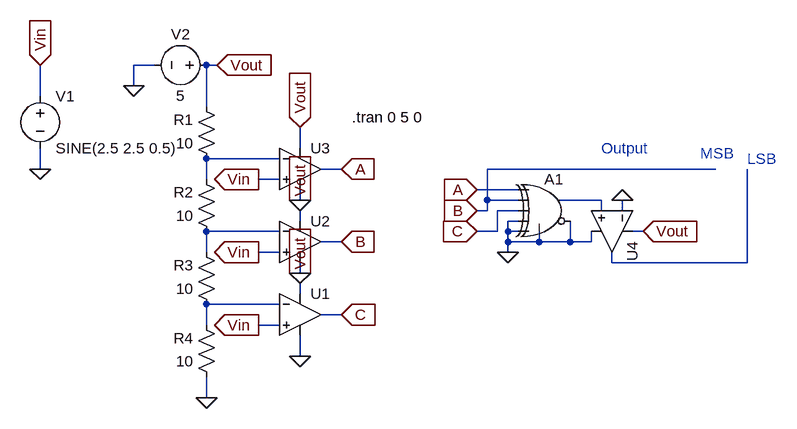
[diagram p0: schematic 2bitADC.asc]
2bitADC.asc, the LTspice schematic file:
Version 4.1
SHEET 1 1728 680
WIRE 288 64 256 64
WIRE 384 64 368 64
WIRE 256 96 256 64
WIRE 112 112 112 64
WIRE 368 128 368 64
WIRE 512 192 512 160
WIRE 480 208 368 208
WIRE 112 224 112 192
WIRE 576 224 544 224
WIRE 1152 224 800 224
WIRE 368 240 368 208
WIRE 480 240 448 240
WIRE 848 256 784 256
WIRE 512 272 512 256
WIRE 800 272 800 224
WIRE 848 272 800 272
WIRE 976 272 912 272
WIRE 800 288 800 272
WIRE 800 288 784 288
WIRE 848 288 816 288
WIRE 976 288 976 272
WIRE 1008 288 1008 272
WIRE 512 304 512 288
WIRE 848 304 832 304
WIRE 480 320 368 320
WIRE 816 320 816 288
WIRE 816 320 784 320
WIRE 832 320 832 304
WIRE 848 320 832 320
WIRE 1040 320 1024 320
WIRE 576 336 544 336
WIRE 832 336 832 320
WIRE 880 336 880 320
WIRE 880 336 832 336
WIRE 928 336 928 304
WIRE 928 336 880 336
WIRE 960 336 960 320
WIRE 960 336 928 336
WIRE 368 352 368 320
WIRE 480 352 448 352
WIRE 832 352 832 336
WIRE 992 368 992 352
WIRE 1200 368 1200 224
WIRE 1200 368 992 368
WIRE 512 384 512 368
WIRE 512 416 512 400
WIRE 480 432 368 432
WIRE 576 448 544 448
WIRE 368 464 368 432
WIRE 480 464 448 464
WIRE 512 512 512 480
WIRE 368 576 368 544
FLAG 112 224 0
FLAG 112 64 Vin
IOPIN 112 64 In
FLAG 256 96 0
FLAG 368 576 0
FLAG 384 64 Vout
IOPIN 384 64 In
FLAG 512 160 Vout
IOPIN 512 160 In
FLAG 512 288 Vout
IOPIN 512 288 In
FLAG 512 400 Vout
IOPIN 512 400 In
FLAG 512 272 0
FLAG 512 384 0
FLAG 512 512 0
FLAG 448 240 Vin
IOPIN 448 240 Out
FLAG 448 352 Vin
IOPIN 448 352 Out
FLAG 448 464 Vin
IOPIN 448 464 Out
FLAG 576 224 A
IOPIN 576 224 In
FLAG 576 336 B
IOPIN 576 336 In
FLAG 576 448 C
IOPIN 576 448 In
FLAG 784 288 B
IOPIN 784 288 In
FLAG 784 320 C
IOPIN 784 320 In
FLAG 784 256 A
IOPIN 784 256 In
FLAG 832 352 0
FLAG 1008 272 0
FLAG 1040 320 Vout
IOPIN 1040 320 In
SYMBOL voltage 112 96 R0
WINDOW 123 24 124 Left 2
WINDOW 39 0 0 Left 0
SYMATTR InstName V1
SYMATTR Value SINE(2.5 2.5 0.5)
SYMBOL voltage 384 64 R90
WINDOW 0 -32 56 VBottom 2
WINDOW 3 32 56 VTop 2
SYMATTR InstName V2
SYMATTR Value 5
SYMBOL res 384 224 R180
WINDOW 0 36 76 Left 2
WINDOW 3 36 40 Left 2
SYMATTR InstName R1
SYMATTR Value 10
SYMBOL res 384 336 R180
WINDOW 0 36 76 Left 2
WINDOW 3 36 40 Left 2
SYMATTR InstName R2
SYMATTR Value 10
SYMBOL res 384 448 R180
WINDOW 0 36 76 Left 2
WINDOW 3 36 40 Left 2
SYMATTR InstName R3
SYMATTR Value 10
SYMBOL res 384 560 R180
WINDOW 0 36 76 Left 2
WINDOW 3 36 40 Left 2
SYMATTR InstName R4
SYMATTR Value 10
SYMBOL OpAmps\\UniversalOpAmp2 512 448 R0
SYMATTR InstName U1
SYMBOL OpAmps\\UniversalOpAmp2 512 336 R0
SYMATTR InstName U2
SYMBOL OpAmps\\UniversalOpAmp2 512 224 R0
SYMATTR InstName U3
SYMBOL Digital\\xor 896 224 R0
SYMATTR InstName A1
SYMBOL OpAmps\\UniversalOpAmp2 992 320 R90
SYMATTR InstName U4
TEXT 592 144 Left 2 !.tran 0 5 0
TEXT 976 192 Left 2 ;Output
TEXT 1128 200 Left 2 ;MSB
TEXT 1200 208 Left 2 ;LSB

The netlist it stands for:
* 2bitADC.asc
V1 Vin 0 SINE(2.5 2.5 0.5)
V2 Vout 0 5
R1 N001 Vout 10
R2 N003 N001 10
R3 N005 N003 10
R4 0 N005 10
X§U1 Vin N005 Vout 0 C level2 Avol=1Meg GBW=10Meg Slew=10Meg Ilimit=25m Rail=0 Vos=0 En=0 Enk=0 In=0 Ink=0 Rin=500Meg  ; pins In+ In- V+ V- OUT
X§U2 Vin N003 Vout 0 B level2 Avol=1Meg GBW=10Meg Slew=10Meg Ilimit=25m Rail=0 Vos=0 En=0 Enk=0 In=0 Ink=0 Rin=500Meg  ; pins In+ In- V+ V- OUT
X§U3 Vin N001 Vout 0 A level2 Avol=1Meg GBW=10Meg Slew=10Meg Ilimit=25m Rail=0 Vos=0 En=0 Enk=0 In=0 Ink=0 Rin=500Meg  ; pins In+ In- V+ V- OUT
A1 A B C 0 0 0 N002 0 XOR
X§U4 N002 0 Vout 0 N004 level2 Avol=1Meg GBW=10Meg Slew=10Meg Ilimit=25m Rail=0 Vos=0 En=0 Enk=0 In=0 Ink=0 Rin=500Meg  ; pins In+ In- V+ V- OUT
.tran 0 5 0
* Output
* MSB
* LSB
.lib UniversalOpAmp2.lib
.backanno
.end